# Altium schematic sheet Main.SchDoc
size A4
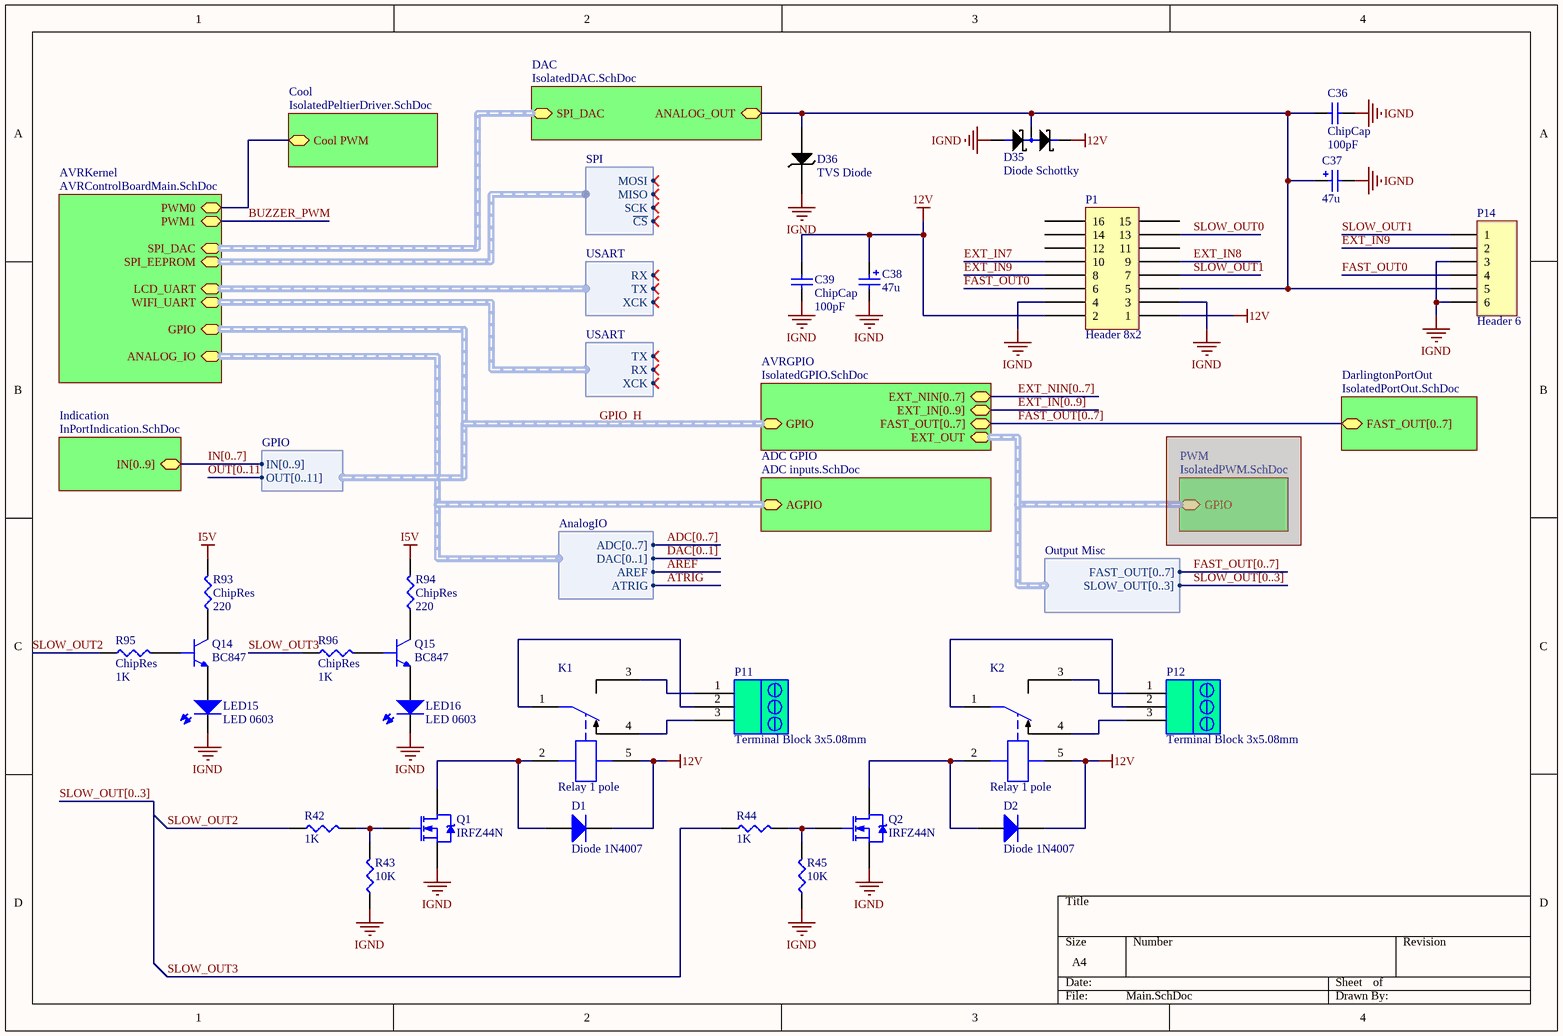
[diagram p0: Main.SchDoc]

## Parts
C36  ChipCap  value 100pF  [CAP0805]
C37  value 47u  [CAPC7343]  (hidden comment: Cap Pol SMD)
C38  value 47u  [CAPC7343]  (hidden comment: Cap Pol SMD)
C39  ChipCap  value 100pF  [CAP0805]
D1  Diode 1N4007  [DO-41]
D2  Diode 1N4007  [DO-41]
D35  Diode Schottky  [SOT23]
D36  TVS Diode  [DO-214AS]
K1  Relay 1 pole  [G5LA]
K2  Relay 1 pole  [G5LA]
LED15  LED 0603  [LED 0603]
LED16  LED 0603  [LED 0603]
P1  Header 8x2  [Header 8x2 HL]
P11  Terminal Block 3x5.08mm  [Socket 3x5.08]
P12  Terminal Block 3x5.08mm  [Socket 3x5.08]
P14  Header 6  [HDR1X6]
Q1  IRFZ44N  [TO-220AB]
Q2  IRFZ44N  [TO-220AB]
Q14  BC847  [SOT23]
Q15  BC847  [SOT23]
R42  value 1K  [RES0805]  (hidden comment: ChipRes)
R43  value 10K  [RES0805]  (hidden comment: ChipRes)
R44  value 1K  [RES0805]  (hidden comment: ChipRes)
R45  value 10K  [RES0805]  (hidden comment: ChipRes)
R93  ChipRes  value 220  [RES0805]
R94  ChipRes  value 220  [RES0805]
R95  ChipRes  value 1K  [RES0805]
R96  ChipRes  value 1K  [RES0805]

## Sub-sheets
ADC GPIO = ADC inputs.SchDoc: AGPIO (harness AnalogIO)
AVRGPIO = IsolatedGPIO.SchDoc: GPIO (harness GPIO), EXT_IN[0..9], EXT_OUT (harness Output Misc), FAST_OUT[0..7], EXT_NIN[0..7]
AVRKernel = AVRControlBoardMain.SchDoc: SPI_DAC (harness SPI), SPI_EEPROM (harness SPI), LCD_UART (harness USART), WIFI_UART (harness USART), ANALOG_IO (harness AnalogIO), GPIO (harness GPIO), PWM0, PWM1
Cool = IsolatedPeltierDriver.SchDoc: Cool PWM
DAC = IsolatedDAC.SchDoc: SPI_DAC (harness SPI), ANALOG_OUT
DarlingtonPortOut = IsolatedPortOut.SchDoc: FAST_OUT[0..7]
Indication = InPortIndication.SchDoc: IN[0..9]
PWM = IsolatedPWM.SchDoc (masked out): GPIO (harness Output Misc)

## Harnesses
USART: TX, RX, XCK
AnalogIO: ADC[0..7], DAC[0..1], AREF, ATRIG
SPI: MOSI, MISO, SCK, ~{CS}
Output Misc: FAST_OUT[0..7], SLOW_OUT[0..3]
GPIO: IN[0..9], OUT[0..11]

## Nets
12V: C38.1 C39.1 D1.2(K) D2.2(K) D35.2 K1.5 K2.5 P1.1 P1.2
I5V: R93.2 R94.2
IGND: C36.2 C37.2 C38.2 C39.2 D35.1 D36.1 LED15.1 LED16.1 P1.3 P1.4 P14.3 P14.6 Q1.3(S) Q2.3(S) R43.1 R45.1
AREF: sheet AVRKernel/ANALOG_IO.AREF
ATRIG: sheet AVRKernel/ANALOG_IO.ATRIG
BUZZER_PWM: sheet AVRKernel/PWM1
EXT_IN7: P1.10
EXT_IN8: P1.9
EXT_IN9: P1.8 P14.2
FAST_OUT0: P1.6 P14.4
SLOW_OUT0: P1.13
SLOW_OUT1: P1.7 P14.1
SLOW_OUT2: R42.1 R95.1
SLOW_OUT3: R44.1 R96.1
NetC36_1: C36.1 C37.1 D35.3 D36.2 P1.5 P14.5 ; sheet DAC/ANALOG_OUT
NetD1_1: D1.1(A) K1.2 Q1.2(D)
NetD2_1: D2.1(A) K2.2 Q2.2(D)
NetK1_1: K1.1 P11.2
NetK1_3: K1.3 P11.1
NetK1_4: K1.4 P11.3
NetK2_1: K2.1 P12.2
NetK2_3: K2.3 P12.1
NetK2_4: K2.4 P12.3
NetLED15_2: LED15.2 Q14.2
NetLED16_2: LED16.2 Q15.2
NetQ1_1: Q1.1(G) R42.2 R43.2
NetQ2_1: Q2.1(G) R44.2 R45.2
NetQ14_1: Q14.1 R95.2
NetQ14_3: Q14.3 R93.1
NetQ15_1: Q15.1 R96.2
NetQ15_3: Q15.3 R94.1
(unnamed): sheet AVRKernel/PWM0, sheet Cool/Cool PWM

Not connected (* = marked no-connect by the designer): P1 11 12 14 15 16

## Buses and harness runs
bus ADC[0..7]
bus DAC[0..1]
bus EXT_IN[0..9] = sheet AVRGPIO/EXT_IN[0..9]
bus EXT_NIN[0..7] = sheet AVRGPIO/EXT_NIN[0..7]
bus FAST_OUT[0..7]
bus FAST_OUT[0..7] = sheet AVRGPIO/FAST_OUT[0..7] = sheet DarlingtonPortOut/FAST_OUT[0..7]
bus IN[0..7] = sheet Indication/IN[0..9]
bus OUT[0..11]
bus SLOW_OUT[0..3]
harness GPIO_H = sheet AVRGPIO/GPIO = sheet AVRKernel/GPIO
harness sheet ADC GPIO/AGPIO = sheet AVRKernel/ANALOG_IO
harness sheet AVRKernel/SPI_DAC = sheet DAC/SPI_DAC

## Library data of the parts
C36 C39 = ChipCap: Capacitor; Published: 8-Jun-2000; LatestRevisionDate: 17-Jul-2002; LatestRevisionNote: Re-released for DXP Platform.; PackageReference: RAD-0.3; Publisher: Altium Limited
C37 C38 = Cap Pol Chip: Polarized Capacitor (Radial); Supplier 1: Digi-Key; Supplier Part Number 1: 399-4029-1-ND
D1 D2 = Diode 1N4007: 1 Amp General Purpose Rectifier; Published: 8-Jun-2000; LatestRevisionDate: 17-Jul-2002; LatestRevisionNote: Re-released for DXP Platform.; DatasheetVersion: 1998; PackageVersion: Aug-1999; PackageReference: DO-41; Publisher: Altium Limited; PackageDescription: Diode, Axial; Body 5.2 x 2.7 mm (LxDia. max), Lead Dia. 0.86 mm (max); Code_JEDEC: DO-204-AL; ComponentLink1Description: Manufacturer Link; ComponentLink1URL: http://www.fairchildsemi.com/; ComponentLink2Description: Datasheet; ComponentLink2URL: http://www.fairchildsemi.com/ds/1N%2F1N4001.pdf
D35 = Schottky Diode: 2-Diode Schottky
D36 = TVS Diode SMA
K1 K2 = Relay G5LE: Relay G5LE 10A Single Pole
LED15 LED16 = LED0603
P1 = Header 16pins (8x2): Header 16pins (8x2) Hold Latch
P11 P12 = Socket_3x5.08_RA_2Wall: Terminal Block Socket Right Angle 3x5.08mm 2-Wall
P14 = Header 6: Header, 6-Pin; LatestRevisionDate: 17-Jul-2002; LatestRevisionNote: Re-released for DXP Platform.; Publisher: Altium Limited
Q1 Q2 = IRFZ44N: HEXFET Power MOSFET; Note: Pin 2 is electrically connected to pin 4.; Published: 8-Jun-2000; LatestRevisionDate: 17-Jul-2002; LatestRevisionNote: Re-released for DXP Platform.; DatasheetVersion: Aug-1997; PackageVersion: Feb-1997; PackageReference: TO-220AB; Publisher: Altium Limited; PackageDescription: TO, Thru-Hole, Vertical, Heatsink Mounted; 3 In-Line Leads; Pitch 2.54 mm; ComponentLink1Description: Manufacturer Link; ComponentLink1URL: http://www.irf.com/; ComponentLink2Description: Datasheet; ComponentLink2URL: http://www.irf.com/product-info/datasheets/data/irfz44n.pdf
Q14 Q15 = BC847: NPN transistor
R42-R45 R93-R96 = ChipRes: Chip resistor